# EAGLE design MAX3232 (EAGLE 5.10)
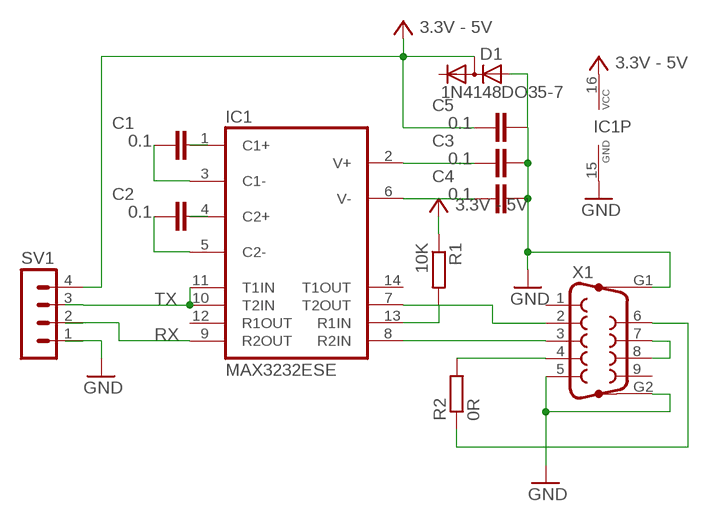
[diagram p0: schematic, sheet 1]

## Parts
C1  0.1  C-EUC0805K  [C0805K]
C2  0.1  C-EUC0805K  [C0805K]
C3  0.1  C-EUC0805K  [C0805K]
C4  0.1  C-EUC0805K  [C0805K]
C5  0.1  C-EUC0805K  [C0805K]
D1  1N4148DO35-7  BAV199  [SOT23]
IC1  MAX3232ESE  [SO16]
R1  10K  R-EU_R0805  [R0805]
R2  0R  R-EU_V234/12  [V234/12]
SV1  MA04-1  [MA04-1]
X1  F09HP  [F09HP]

## Nets
GND: C3.2 C4.2 C5.2 D1.1(A) IC1.15(GND) SV1.1 X1.5 X1.G1 X1.G2
N$1: IC1.7(T2OUT) X1.2
N$2: IC1.8(R2IN) X1.3
N$3: X1.7 X1.8
N$4: R2.1 X1.6
N$5: C1.1 IC1.3(C1-)
N$6: C2.2 IC1.4(C2+)
N$7: C1.2 IC1.1(C1+)
N$8: IC1.13(R1IN) R1.2
N$9: C4.1 IC1.6(V-)
N$10: C3.1 IC1.2(V+)
N$11: C2.1 IC1.5(C2-)
N$17: R2.2 X1.4
RX: IC1.9(R2OUT) SV1.2
TX: IC1.10(T2IN) IC1.11(T1IN) SV1.3
VCC: C5.1 D1.3(AC) IC1.16(VCC) R1.1 SV1.4 ; supply symbol labelled 3.3V - 5V
Unconnected: D1.2(C) IC1.12(R1OUT) IC1.14(T1OUT) X1.1 X1.9

## Library data of the parts
C1-C5 = rcl:C-EU: CAPACITOR, European symbol
D1 = diode:BAV199: DIODE low-leakage double diode
IC1 = maxim:MAX3232*: True RS-232 Transceivers 3.0V to 5.5V, Low-Power up to 1Mbps, Using Four 0.1µF External Capacitors Source: http://pdfserv.maxim-ic.com/en/ds/MAX3222-MAX3241.pdf
R1 R2 = rcl:R-EU_: RESISTOR, European symbol
SV1 = con-lstb:MA04-1: PIN HEADER
X1 = con-subd:F09HP: SUB-D

## Board
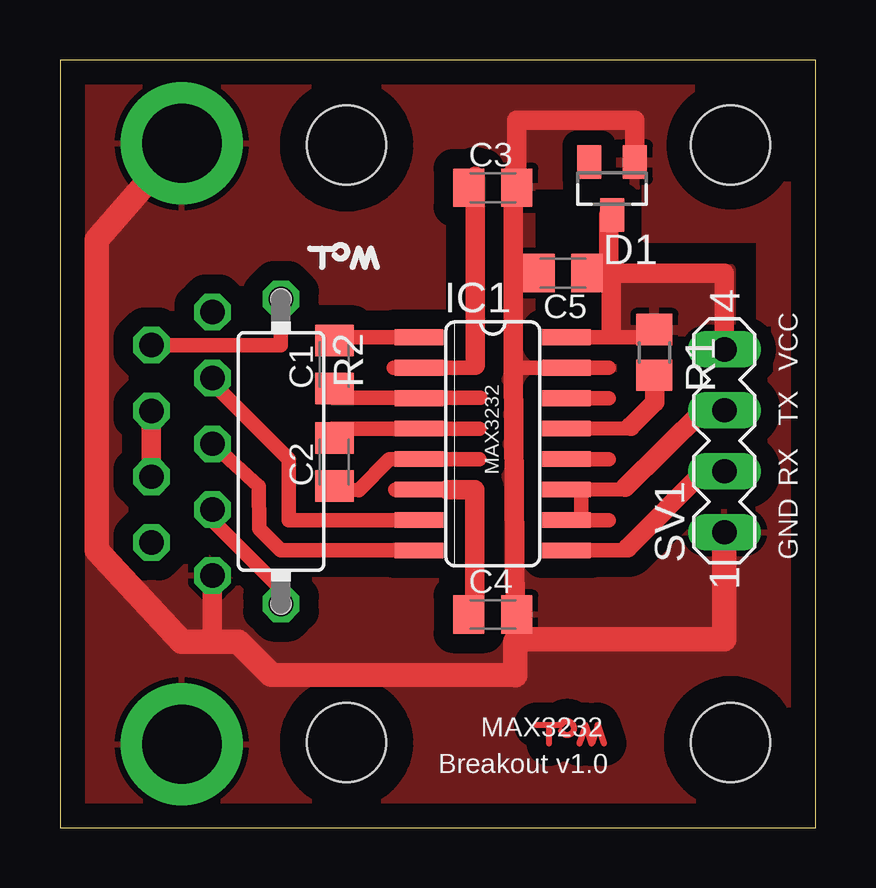
[diagram p1: board, top side]
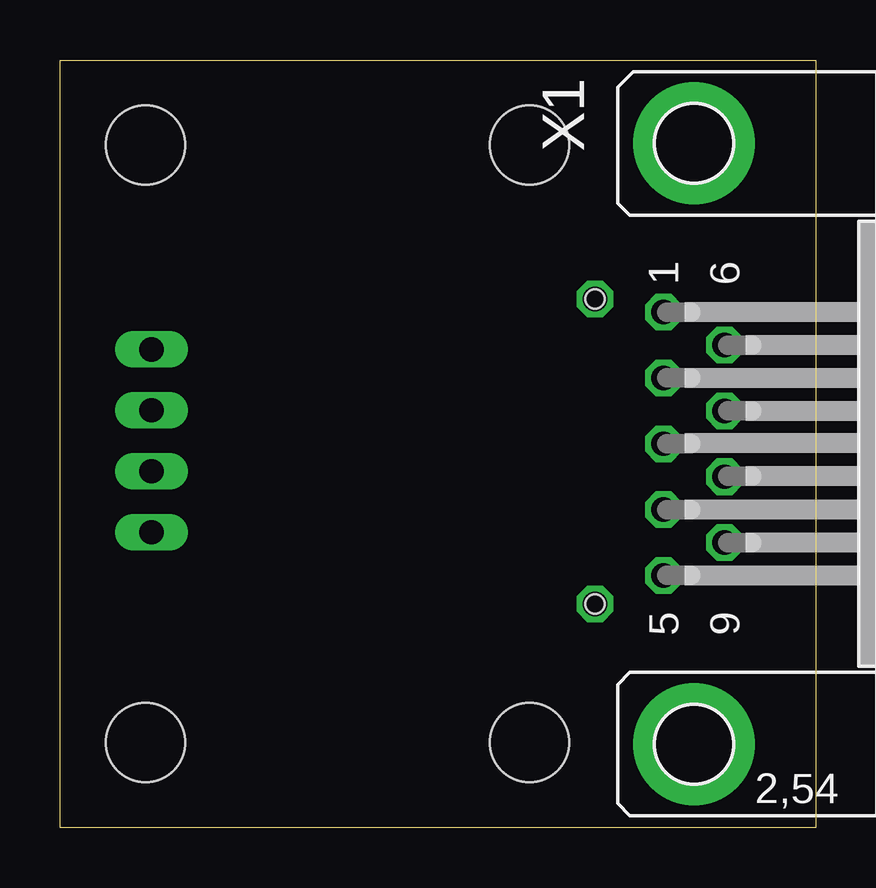
[diagram p2: board, bottom side, seen from below]

Size 31.5 x 31.99 mm. Coordinates in mm from the lower left corner, seen from the top.
Outline: 31.5,0 31.5,31.99 0,31.99 0,0 31.5,0
Copper layers (1*16): Top 0.035mm / dielectric 1.5mm / Bottom 0.035mm
Design rules "default": minimum track width 10mil, minimum drill 24mil, track to track 8mil, track to pad 8mil, pad to pad 8mil, via to via 8mil, smd to smd 8mil, copper to edge 40mil, drill to drill 8mil, minimum pad ring 10mil, minimum via ring 8mil, stop-mask expansion 4mil, vias tented up to drill 0mil, thermal gap 10mil
Holes 0.8 mm at 9.21,22.03 9.21,9.33

### Footprints (pad centres in the part's own frame; a part is rotated, then mirrored left to right if it is on the bottom)
C0805K = smd 1.3 x 1.6: 1 -1,0; 2 1,0
SOT23 = smd 1 x 1.4: 1 -0.95,-1.1; 2 0.95,-1.1; 3 0,1.1
SO16 = smd 0.66 x 2.032: 1 -4.445,-3.073; 2 -3.175,-3.073; 3 -1.905,-3.073; 4 -0.635,-3.073; 5 0.635,-3.073; 6 1.905,-3.073; 7 3.175,-3.073; 8 4.445,-3.073; 9 4.445,3.073; 10 3.175,3.073; 11 1.905,3.073; 12 0.635,3.073; 13 -0.635,3.073; 14 -1.905,3.073; 15 -3.175,3.073; 16 -4.445,3.073
R0805 = smd 1.3 x 1.5: 1 -0.95,0; 2 0.95,0
V234/12 = drill 1.016 octagon: 1 -6.35,0; 2 6.35,0
MA04-1 = drill 1.016 long: 1 -3.81,0; 2 -1.27,0; 3 1.27,0; 4 3.81,0
STAND-OFF = hole 3.302: 0,0
F09HP = drill 1.016 octagon: 1 -5.486,-1.27; 2 -2.743,-1.27; 3 0,-1.27; 4 2.743,-1.27; 5 5.486,-1.27; 6 -4.115,1.27; 7 -1.372,1.27; 8 1.372,1.27; 9 4.115,1.27 | drill 3.302 pad 5.08 round: G1 -12.522,0; G2 12.522,0

### Placement (x,y rotation side)
C1  11.43,19.3 90 top
C2  11.43,15.24 90 top
C3  18.03,26.67 0 top
C4  18.03,8.89 0 top
C5  20.96,23.11 180 top
D1  23,26.64 180 top
IC1  18.03,16 270 top
R1  24.77,19.81 270 top
R2  9.21,15.68 270 top
SV1  27.69,16.13 90 top
U$1  [STAND-OFF]  11.94,28.45 0 top
U$2  [STAND-OFF]  27.94,28.45 0 top
U$3  [STAND-OFF]  27.94,3.56 0 top
U$4  [STAND-OFF]  11.94,3.56 0 top
X1  5.08,16 270 bottom

### Tracks (layer width: path | path; a pad name or v marks a point on that pad's centre or on a via)
GND
  Top 0.254: 18.98,6.42 19.14,7.85 | 19.71,23.23 19.11,22.89 C5.2 | 6.35,10.29 X1.5 | 18.96,7.75 18.98,6.42 | 18.98,6.42 C4.2
  Top 0.305: 19.11,22.89 18.8,25 18.89,19.18
  Top 0.406: 23.96,29.49 23.95,29.49 | 8.8,6.38 8.84,6.38
  Top 0.61: 18.89,19.18 20.96,19.18 IC1.15 22.86,19.18
  Top 0.813: 23.96,29.49 19.04,29.49 C3.2 arc90 18.9,27.29 18.9,27.14 18.89,23.1 | 18.89,23.1 19.71,23.23 19.86,22.83 19.11,22.89 | 18.98,6.42 18.89,19.18 18.89,23.1 | 6.35,7.75 6.35,10.29 | 23.95,29.49 D1.1
  Top 1.016: 19.14,7.85 27.69,7.86 SV1.1 | X1.G1 5.08,28.57 1.52,24.51 1.52,11.56 5.08,7.75 6.35,7.75 7.43,7.75 8.8,6.38 | 18.96,7.75 18.96,6.35 8.84,6.38
  pour Top (isolate 0.813): -0.64,32.83 19.68,32.83 19.68,19.72 32.54,19.72 32.56,-1.06 -0.64,-1.14
  pour Top (isolate 0.61): 19.05,33.15 32.7,33.15 32.7,19.18 29.84,19.18 29.84,21.08 29.21,21.08 29.21,24.57 24.45,24.57 24.45,26.8 19.05,26.8
N$1
  Top 0.254: 14.72,12.8 15.56,12.92 IC1.7
  Top 0.61: 14.72,12.8 IC1.7 14.7,12.82 14.64,12.83 14.87,12.82 9.53,12.82 9.53,15.37 6.35,18.54 X1.2
N$2
  Top 0.254: 14.49,11.56 14.04,11.53 13.81,11.53
  Top 0.406: 13.81,11.53 14.96,11.68 IC1.8
  Top 0.61: X1.3 8.29,14.22 8.3,12.46 9.21,11.56 14.49,11.56
N$3
  Top 0.813: X1.8 X1.7
N$4
  Top 0.61: X1.6 9.21,20.12 R2.1
N$5
  Top 0.254: 11.37,17.92 C1.1 | 14.96,18.03 IC1.3
  Top 0.305: 17.5,17.91 14.96,18.03
  Top 0.61: 11.37,17.92 17.5,17.91
N$6
  Top 0.254: 11.68,16.26 C2.2
  Top 0.406: IC1.4 15.56,16.64
  Top 0.61: 11.68,16.26 11.5,16.26 11.34,16.64 IC1.4 | 15.56,16.64 17.46,16.64
N$7
  Top 0.254: C1.2 11.68,20.32
  Top 0.61: 11.68,20.32 11.6,20.32 11.76,20.45 IC1.1
N$8
  Top 0.61: IC1.13 23.48,16.64 23.81,16.64 23.79,16.74
  Top 0.813: 23.79,16.74 24.78,17.73 R1.2
N$9
  Top 0.254: C4.1 17.27,8.64 | 16.13,14.1 IC1.6
  Top 0.813: 17.27,8.64 17.27,14.09 16.13,14.1
N$10
  Top 0.254: 13.91,19.18 IC1.2
  Top 0.406: 17.31,27.14 16.69,27.07 16.95,26.94 C3.1
  Top 0.61: 13.91,19.18 14.66,19.17 17.3,19.17 17.3,19.27
  Top 0.813: 17.3,19.27 17.3,24.31 17.31,27.14
N$11
  Top 0.254: C2.1 11.68,14.35
  Top 0.406: IC1.5 15.24,15.37
  Top 0.61: 11.68,14.35 11.81,14.08 12.44,14.08 13.72,15.37 IC1.5 | 15.24,15.37 17.46,15.37
N$12
  Top 0.254: 20.37,4.28 19.86,4.28 | 20.37,4.28 20.88,4.28 arc-307 20.88,4.03 | 20.37,4.28 20.37,3.52
N$13
  Top 0.254: 21.64,3.52 21.9,4.28 22.15,3.52 22.4,4.28 22.66,3.52
N$14
  Top 0.61: 14.92,14.1 13.97,14.1
N$15
  Top 0.61: 21.27,15.37 22.86,15.37
N$16
  Top 0.61: 21.91,17.91 22.86,17.91
N$17
  Top 0.61: R2.2 9.21,9.97 6.35,12.83 X1.4
RX
  Top 0.254: 21.73,11.56 21.58,11.56 IC1.9
  Top 0.61: 21.73,11.56 23.67,11.56 23.61,11.66 23.65,11.68
  Top 0.813: 23.65,11.68 26.85,14.88 SV1.2
TX
  Top 0.254: IC1.10 21.59,12.83 21.72,12.83 | 21.72,14.1 IC1.11
  Top 0.61: 21.72,12.83 21.72,14.1 23.51,14.1 23.55,14.19 | 21.59,12.83 22.86,12.83
  Top 0.813: 23.55,14.19 26.8,17.41 27.3,17.4 SV1.3
VCC
  Top 0.254: 21.21,20.45 21.9,20.47 21.3,20.47 21.31,20.53 20.45,20.45 | 22.96,22.85 22.87,22.84 22.57,22.81 C5.1 | 23,23.22 23.37,23.11 | IC1.16 21.66,20.45 21.67,20.45
  Top 0.406: 24.77,20.45 R1.1 | 22.87,25.54 D1.3
  Top 0.61: 20.45,20.45 21.67,20.45 23.16,20.45 | 23.16,20.45 22.96,20.6 | 23.16,20.45 24.77,20.45
  Top 0.813: C5.1 22.01,23.14 arc-5 23,23.22 | 23.37,23.11 27.69,23.11 SV1.4 | 22.96,20.6 22.96,22.85 | 22.87,22.84 22.87,25.54
  pour Top: 23.18,23.3 27.94,23.3 27.94,20.45 23.18,20.45

### Text on the board
tPlace: VCC | TX | MAX3232 | RX | GND | MAX3232 | Breakout v1.0